# Altium schematic sheet #NIP涡轮驱动板-DRIVE.SchDoc
size A3
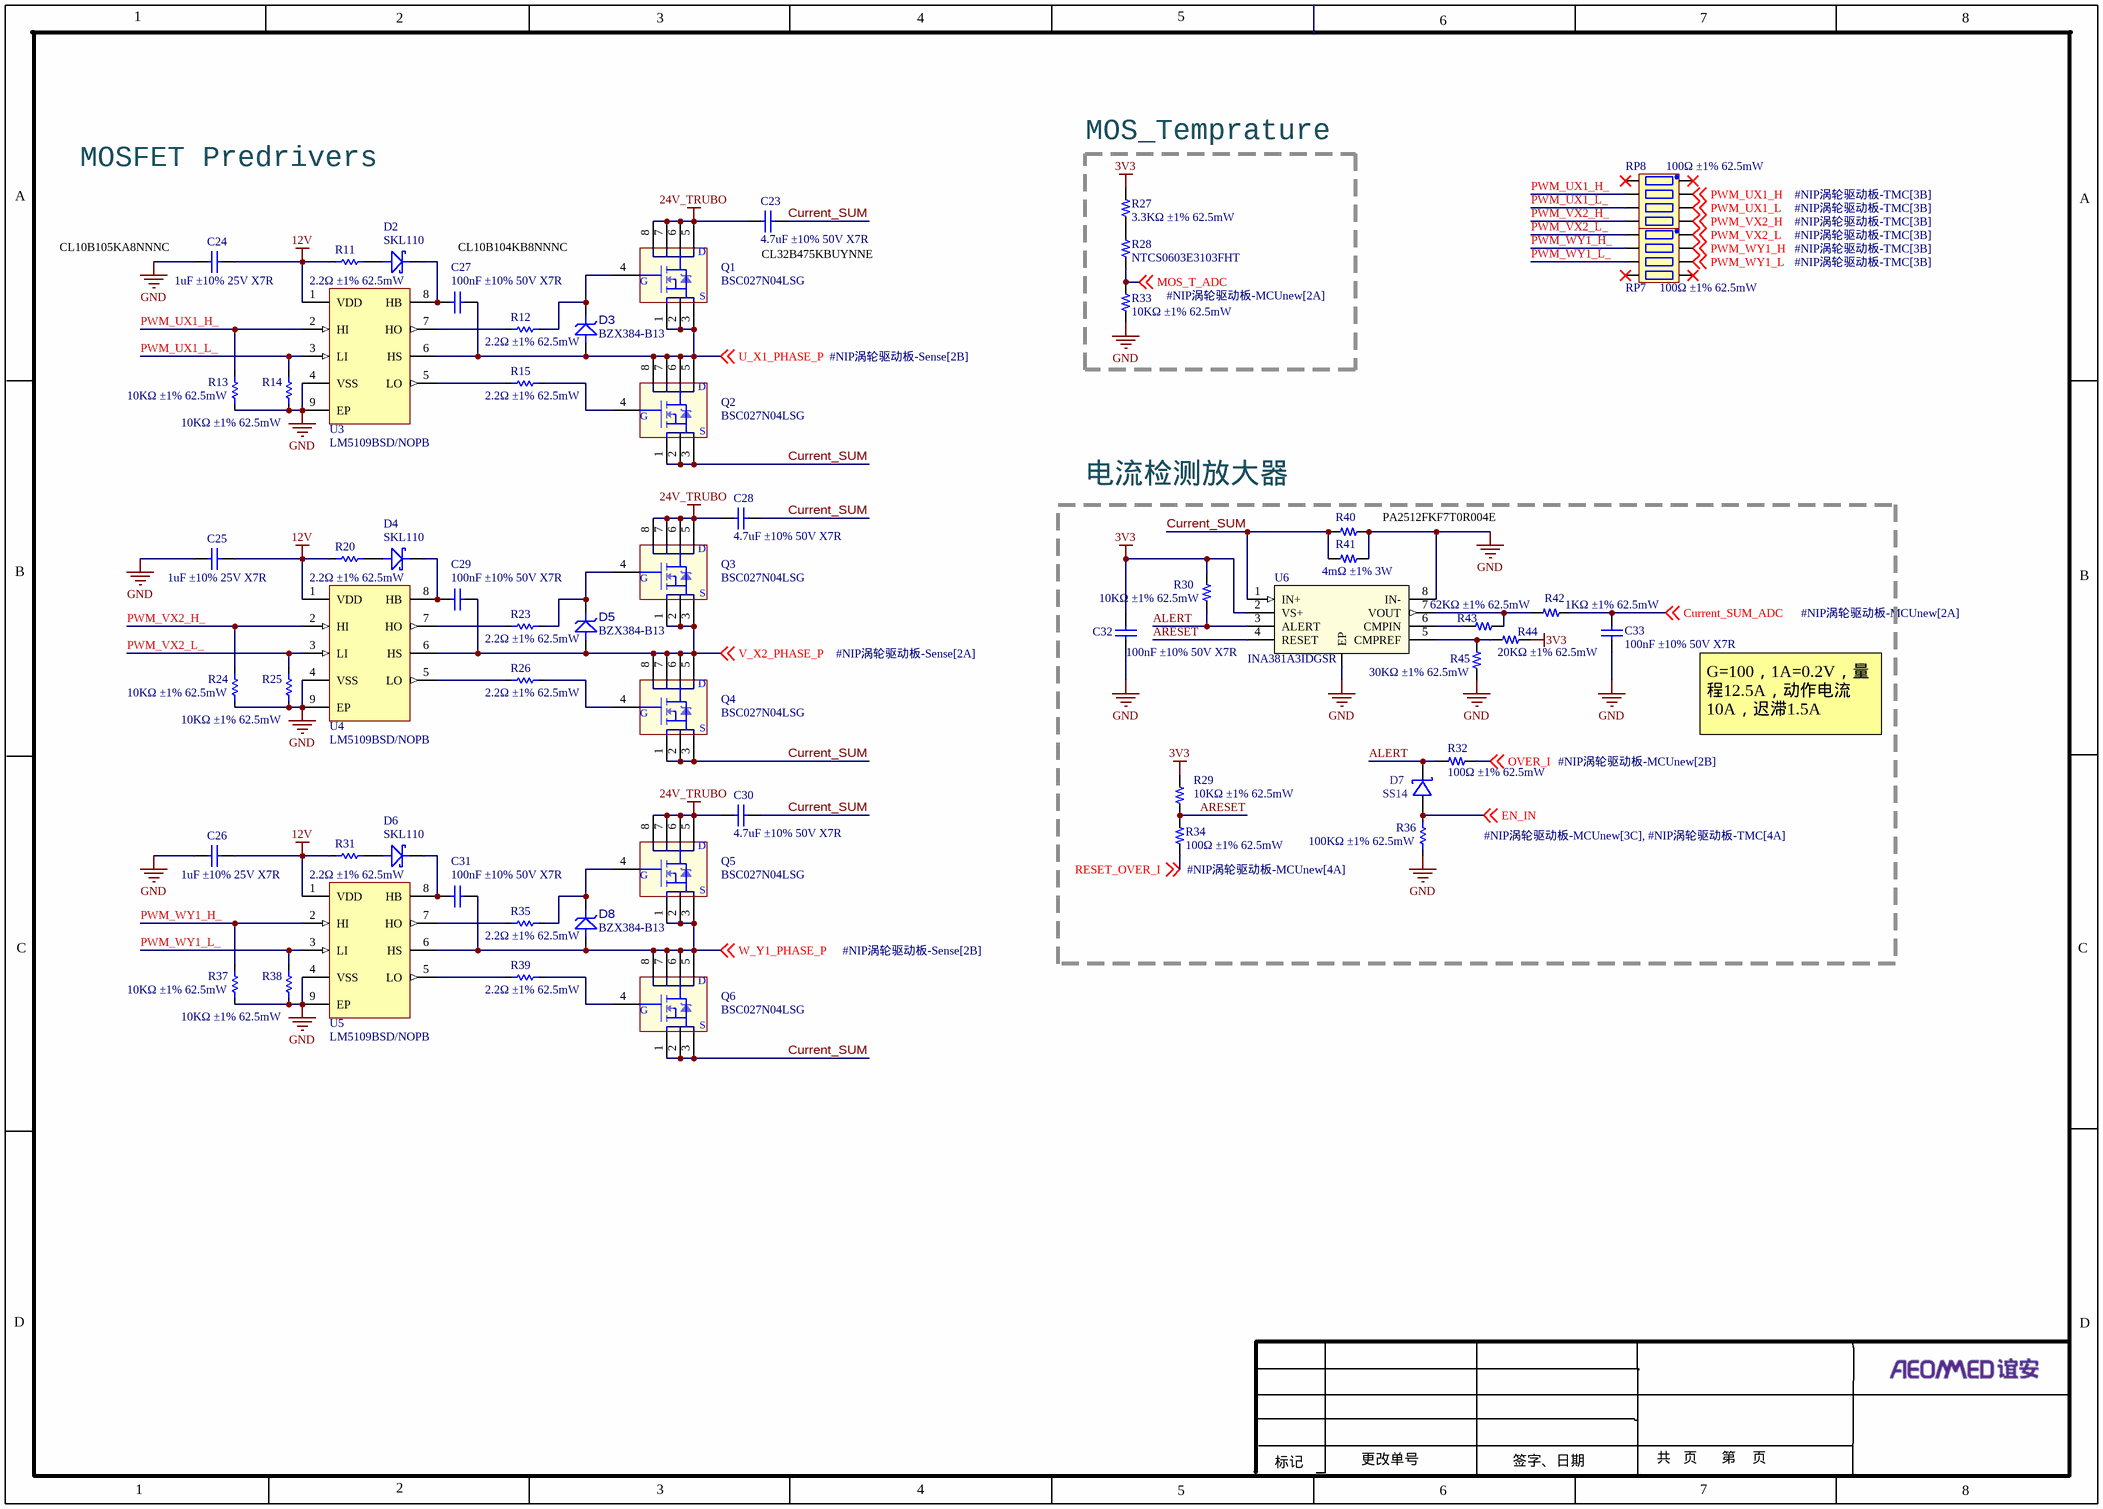
[diagram p0: #NIP涡轮驱动板-DRIVE.SchDoc]

## Parts
C23  4.7uF ±10% 50V X7R  [C-1210]
C24  1uF ±10% 25V X7R  [C0603]
C25  1uF ±10% 25V X7R  [C0603]
C26  1uF ±10% 25V X7R  [C0603]
C27  100nF ±10% 50V X7R  [C-0603]
C28  4.7uF ±10% 50V X7R  [C-1210]
C29  100nF ±10% 50V X7R  [C-0603]
C30  4.7uF ±10% 50V X7R  [C-1210]
C31  100nF ±10% 50V X7R  [C-0603]
C32  100nF ±10% 50V X7R  [C0402]
C33  100nF ±10% 50V X7R  [C0402]
D2  SKL110  [SODFL370X140-2N]
D3  BZX384-B13  [SOD2512X100N]
D4  SKL110  [SODFL370X140-2N]
D5  BZX384-B13  [SOD2512X100N]
D6  SKL110  [SODFL370X140-2N]
D7  SS14  [SOD-123_L2.7-W1.6-LS3.7-RD]
D8  BZX384-B13  [SOD2512X100N]
Q1  BSC027N04LSG  [PG-TDSON-8]
Q2  BSC027N04LSG  [PG-TDSON-8]
Q3  BSC027N04LSG  [PG-TDSON-8]
Q4  BSC027N04LSG  [PG-TDSON-8]
Q5  BSC027N04LSG  [PG-TDSON-8]
Q6  BSC027N04LSG  [PG-TDSON-8]
R11  2.2Ω ±1% 62.5mW  [R0402]
R12  2.2Ω ±1% 62.5mW  [R0402]
R13  10KΩ ±1% 62.5mW  [R0402]
R14  10KΩ ±1% 62.5mW  [R0402]
R15  2.2Ω ±1% 62.5mW  [R0402]
R20  2.2Ω ±1% 62.5mW  [R0402]
R23  2.2Ω ±1% 62.5mW  [R0402]
R24  10KΩ ±1% 62.5mW  [R0402]
R25  10KΩ ±1% 62.5mW  [R0402]
R26  2.2Ω ±1% 62.5mW  [R0402]
R27  3.3KΩ ±1% 62.5mW  [R0402]
R28  NTCS0603E3103FHT  [R-0603]
R29  10KΩ ±1% 62.5mW  [R0402]
R30  10KΩ ±1% 62.5mW  [R0402]
R31  2.2Ω ±1% 62.5mW  [R0402]
R32  100Ω ±1% 62.5mW  [R0402]
R33  10KΩ ±1% 62.5mW  [R0402]
R34  100Ω ±1% 62.5mW  [R0402]
R35  2.2Ω ±1% 62.5mW  [R0402]
R36  100KΩ ±1% 62.5mW  [R0402]
R37  10KΩ ±1% 62.5mW  [R0402]
R38  10KΩ ±1% 62.5mW  [R0402]
R39  2.2Ω ±1% 62.5mW  [R0402]
R40  4mΩ ±1% 3W  [R-2512_4PIN]  (value not drawn)
R41  4mΩ ±1% 3W  [R-2512_4PIN]
R42  1KΩ ±1% 62.5mW  [R0402]
R43  62KΩ ±1% 62.5mW  [R0402]
R44  20KΩ ±1% 62.5mW  [R0402]
R45  30KΩ ±1% 62.5mW  [R0402]
RP7  100Ω ±1% 62.5mW  [RES-ARRAY-SMD_0402-8P-L2.0-W1.0-BL]
RP8  100Ω ±1% 62.5mW  [RES-ARRAY-SMD_0402-8P-L2.0-W1.0-BL]
U3  LM5109BSD/NOPB  [PSON80P400X80_HS-9N]
U4  LM5109BSD/NOPB  [PSON80P400X80_HS-9N]
U5  LM5109BSD/NOPB  [PSON80P400X80_HS-9N]
U6  INA381A3IDGSR  [WSON-8_L2.0-W2.0-P0.50-BL-EP0.9]

## Blocks framed on the sheet
MOS_Temprature: R27 R28 R33
电流检测放大器: C32 C33 D7 R29 R30 R32 R34 R36 R40-R45 U6

## Nets
3V3: C32.1 R27.2 R29.1 R30.1 R44.2 U6.2(VS+)
12V: C24.1 C25.1 C26.1 R11.1 R20.1 R31.1 U3.1(VDD) U4.1(VDD) U5.1(VDD)
24V_TRUBO: C23.2 C28.2 C30.2 Q1.5(D) Q1.6(D) Q1.7(D) Q1.8(D) Q3.5(D) Q3.6(D) Q3.7(D) Q3.8(D) Q5.5(D) Q5.6(D) Q5.7(D) Q5.8(D)
GND: C24.2 C25.2 C26.2 C32.2 C33.1 R13.1 R14.1 R24.1 R25.1 R33.1 R36.2 R37.1 R38.1 R40.1 R41.1 R45.1 U3.4(VSS) U3.9(EP) U4.4(VSS) U4.9(EP) U5.4(VSS) U5.9(EP) U6.8(IN-) U6.9(EP)
ALERT: D7.1(K) R30.2 R32.1 U6.3(ALERT)
ARESET: R29.2 R34.1 U6.4(RESET)
Current_SUM: C23.1 C28.1 C30.1 Q2.1(S) Q2.2(S) Q2.3(S) Q4.1(S) Q4.2(S) Q4.3(S) Q6.1(S) Q6.2(S) Q6.3(S) R40.2 R41.2 U6.1(IN+)
Current_SUM_ADC: C33.2 R42.2 ; off-sheet Current_SUM_ADC
EN_IN: D7.2(A) R36.1 ; off-sheet EN_IN
MOS_T_ADC: R28.1 R33.2 ; off-sheet MOS_T_ADC
OVER_I: R32.2 ; off-sheet OVER_I
PWM_UX1_H: RP8.2 ; off-sheet PWM_UX1_H
PWM_UX1_H_: R13.2 RP8.7 U3.2(HI)
PWM_UX1_L: RP8.3 ; off-sheet PWM_UX1_L
PWM_UX1_L_: R14.2 RP8.6 U3.3(LI)
PWM_VX2_H: RP8.4 ; off-sheet PWM_VX2_H
PWM_VX2_H_: R24.2 RP8.5 U4.2(HI)
PWM_VX2_L: RP7.1 ; off-sheet PWM_VX2_L
PWM_VX2_L_: R25.2 RP7.8 U4.3(LI)
PWM_WY1_H: RP7.2 ; off-sheet PWM_WY1_H
PWM_WY1_H_: R37.2 RP7.7 U5.2(HI)
PWM_WY1_L: RP7.3 ; off-sheet PWM_WY1_L
PWM_WY1_L_: R38.2 RP7.6 U5.3(LI)
RESET_OVER_I: R34.2 ; off-sheet RESET_OVER_I
U_X1_PHASE_P: C27.1 D3.2(A) Q1.1(S) Q1.2(S) Q1.3(S) Q2.5(D) Q2.6(D) Q2.7(D) Q2.8(D) U3.6(HS) ; off-sheet U_X1_PHASE_P
V_X2_PHASE_P: C29.1 D5.2(A) Q3.1(S) Q3.2(S) Q3.3(S) Q4.5(D) Q4.6(D) Q4.7(D) Q4.8(D) U4.6(HS) ; off-sheet V_X2_PHASE_P
W_Y1_PHASE_P: C31.1 D8.2(A) Q5.1(S) Q5.2(S) Q5.3(S) Q6.5(D) Q6.6(D) Q6.7(D) Q6.8(D) U5.6(HS) ; off-sheet W_Y1_PHASE_P
NetC27_2: C27.2 D2.1 U3.8(HB)
NetC29_2: C29.2 D4.1 U4.8(HB)
NetC31_2: C31.2 D6.1 U5.8(HB)
NetD2_2: D2.2 R11.2
NetD3_1: D3.1(K) Q1.4(G) R12.2
NetD4_2: D4.2 R20.2
NetD5_1: D5.1(K) Q3.4(G) R23.2
NetD6_2: D6.2 R31.2
NetD8_1: D8.1(K) Q5.4(G) R35.2
NetQ2_4: Q2.4(G) R15.2
NetQ4_4: Q4.4(G) R26.2
NetQ6_4: Q6.4(G) R39.2
NetR12_1: R12.1 U3.7(HO)
NetR15_1: R15.1 U3.5(LO)
NetR23_1: R23.1 U4.7(HO)
NetR26_1: R26.1 U4.5(LO)
NetR27_1: R27.1 R28.2
NetR35_1: R35.1 U5.7(HO)
NetR39_1: R39.1 U5.5(LO)
NetR42_1: R42.1 R43.2 U6.7(VOUT)
NetR43_1: R43.1 U6.6(CMPIN)
NetR44_1: R44.1 R45.2 U6.5(CMPREF)

Not connected (* = marked no-connect by the designer): RP7 4* 5*; RP8 1* 8*

## Notes on the sheet
- MOSFET Predrivers
- (near C24) CL10B105KA8NNNC
- CL10B104KB8NNNC
- (near C23) CL32B475KBUYNNE
- PA2512FKF7T0R004E
- G=100，1A=0.2V，量程12.5A，动作电流10A，迟滞1.5A
- 1
- 2
- 3
- 4
- 5
- 6
- 7
- 8
- A
- B
- C
- D
- 更改单号
- 共   页      第    页
- 标记
- 签字、日期

## Library data of the parts
C23 C28 C30 = C-1210: CL32B475KBUYNNE
C24-C26 = Cap: CL10B105KA8NNNC; Published: 8-Jun-2000; LatestRevisionDate: 17-Jul-2002; LatestRevisionNote: Re-released for DXP Platform.; PackageReference: RAD-0.3; Publisher: Altium Limited; PackageDescription: Radial Cap, Thru-Hole; 2 Leads; 0.3 in Pin Spacing
C27 C29 C31 = C-0603: CL10B104KB8NNNC; 物料编号: *; 物料名称: *; 厂家: *; 详细描述: *
C32 C33 = Cap: Capacitor; Published: 8-Jun-2000; LatestRevisionDate: 17-Jul-2002; LatestRevisionNote: Re-released for DXP Platform.; PackageReference: RAD-0.3; Publisher: Altium Limited; PackageDescription: Radial Cap, Thru-Hole; 2 Leads; 0.3 in Pin Spacing
D2 D4 D6 = 50491: 品牌：DIOTEC，型号：SKL110，1A，100V，ROHS; Manufacturer: Diotec  Semiconductor; Id: 50491; Type: Diode; Value: 1A, 100V; Part Number: SKL110; HelpURL: http://diotec.com/tl_files/diotec/files/pdf/datasheets/skl12
D3 D5 D8 = ZENER: 品牌：NXP，型号：BZX384-B13，13V，SOD-323，ROHS; Manufacturer: Nexperia; Id: 50513; Type: ZEN; Value: 13V, 0.3W; Part Number: BZX384-B13; HelpURL: http://assets.nexperia.com/documents/data-sheet/BZX384_SERIES.pdf
D7 = Diode_Schottky: 直流反向耐压(Vr):40V;平均整流电流(Io):3A;正向压降(Vf):500mV@3A;; Manufacturer: DIODES(美台); Name: B340A-13-F; Add into BOM: yes; Reverse Voltage (Vr): 40V; Average Rectified Current (Io): 3A; Symbol: B340A-13-F; Device: B340A-13-F; LCSC Part Name: 40V 3A 500mV@3A; Supplier Part: C85098; Manufacturer Part: B340A-13-F; Supplier Footprint: SMA(DO-214AC); JLCPCB Part Class: 扩展库; Datasheet: https://atta.szlcsc.com/upload/public/pdf/source/20171023/C134454_15087453575121052549.pdf; Supplier: LCSC; Convert to PCB: yes; Forward Voltage (Vf@If): 500mV@3A
Q1-Q6 = BSC027N04LS: 品牌：INFINEON，型号： BSC027N04LSG，40V，100A，ROHS; 版本: V1.00; 名称: BSC030N08NS5ATMA1; 物料编号: apply; 详细描述: 品牌：INFINEON，型号： BSC027N04LSG，40V，100A，ROHS; 制造商: Infineon
R11 R20 R31 = Res_0402: Resistor; Published: 8-Jun-2000; LatestRevisionDate: 17-Jul-2002; LatestRevisionNote: Re-released for DXP Platform.; PackageReference: AXIAL-0.3; Publisher: Altium Limited; PackageDescription: Axial Device, Thru-Hole; 2 Leads; 0.3 in Pin Spacing
R12-R15 R23-R26 R35 R37-R39 = Res: Resistor; Published: 8-Jun-2000; LatestRevisionDate: 17-Jul-2002; LatestRevisionNote: Re-released for DXP Platform.; PackageReference: AXIAL-0.3; Publisher: Altium Limited; PackageDescription: Axial Device, Thru-Hole; 2 Leads; 0.3 in Pin Spacing
R27 R29 R30 R32-R34 R42-R45 = R-0603
R28 = R-0603: 品牌：VISHAY，型号：NTCS0603E3103FHT，10K@25℃, 1%，B=3960,ROHS
R36 = Res_0402: RC0402FR-07100KL; Published: 8-Jun-2000; LatestRevisionDate: 17-Jul-2002; LatestRevisionNote: Re-released for DXP Platform.; PackageReference: AXIAL-0.3; Publisher: Altium Limited; PackageDescription: Axial Device, Thru-Hole; 2 Leads; 0.3 in Pin Spacing
R40 R41 = R-2512: PA2512FKF7T0R004E
RP7 RP8 = RP-0603
U3-U5 = LM5109: 品牌：TI，型号：LM5109BSD/NOPB，ROHS; Manufacturer: Texas Instruments; Id: 50490; Value: 108V 1A; Part Number: LM5109BSD/NOPB; Type: DRV; HelpURL: http://www.ti.com/lit/ds/symlink/lm5109b.pdf
U6 = INA381A2IDSGR: 品牌：TI，型号：INA381A1IDGSR，ROHS; Mfr_Name: Texas Instruments; Copyright: Copyright (C) 2022 Ultra Librarian. All rights reserved.; Manufacturer_Part_Number: INA381A3IDGSR; RefDes: RefDes; Type: DEV